# Altium schematic sheet RXTX4.SchDoc
size A
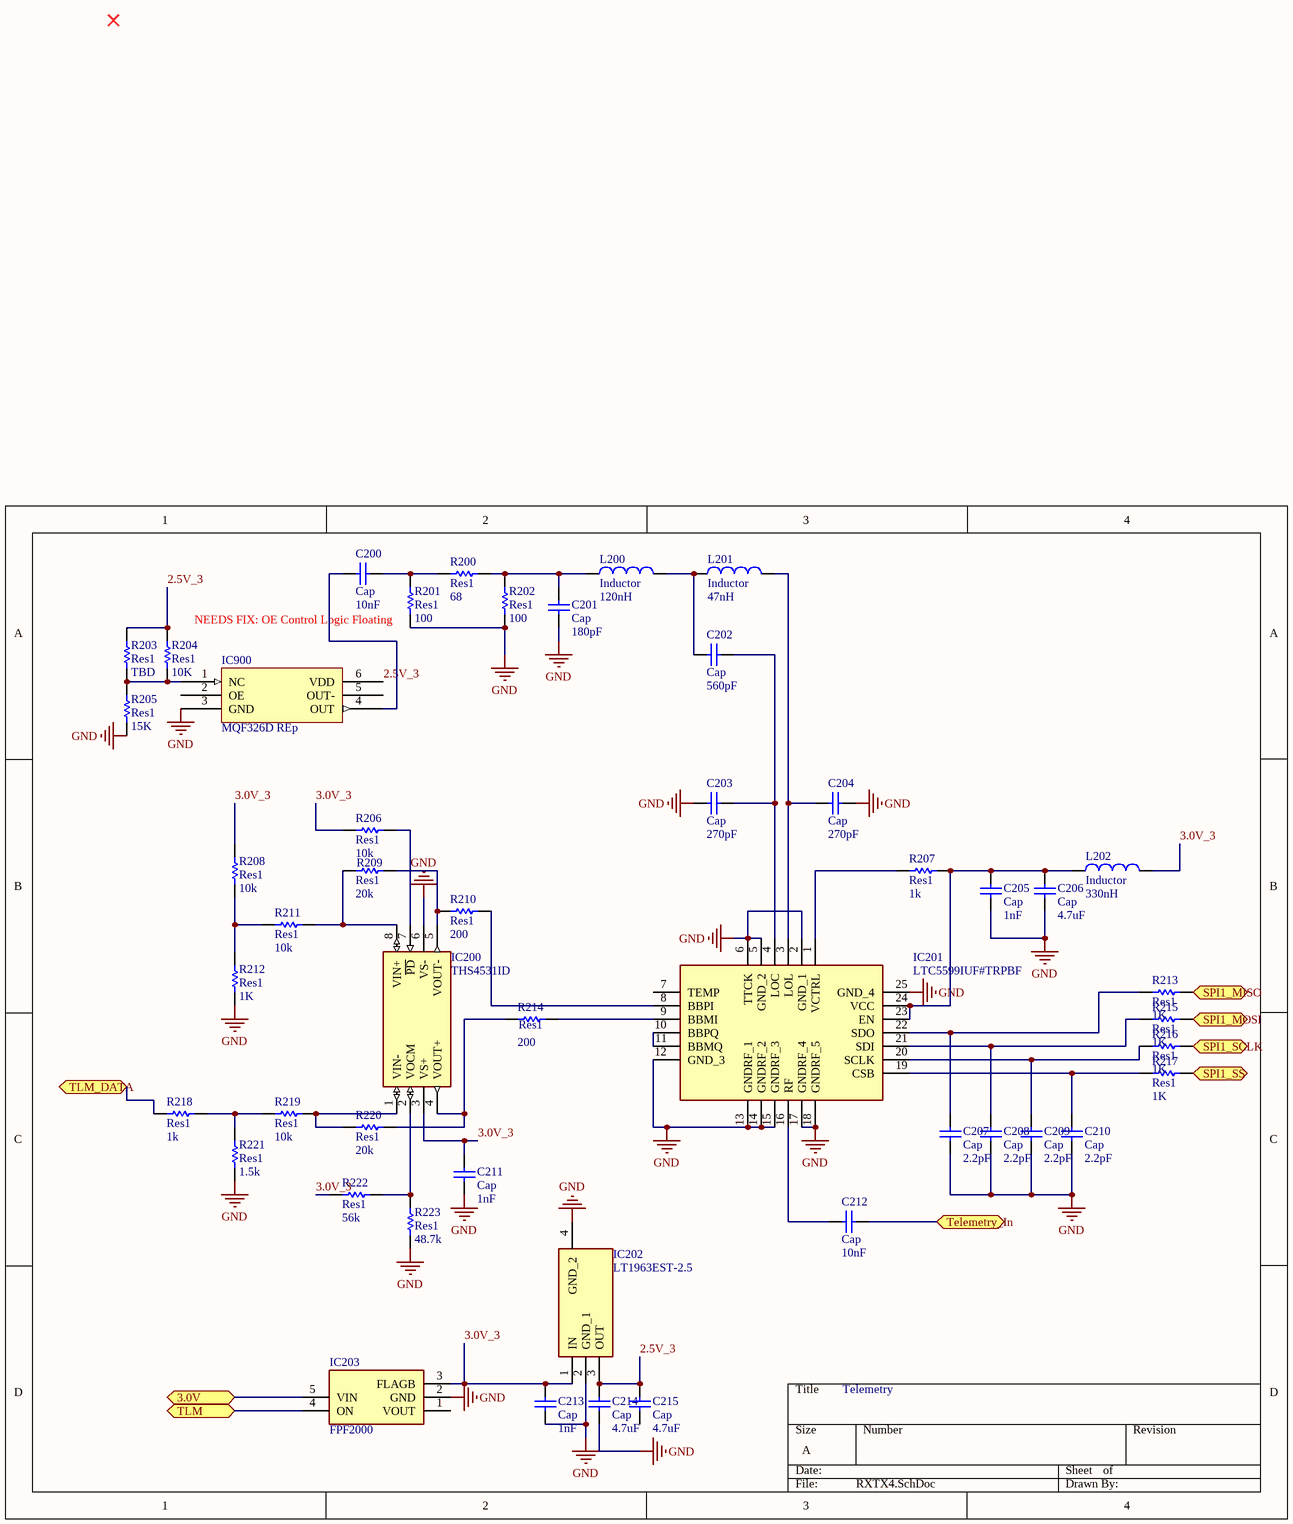
[diagram p0: RXTX4.SchDoc]

## Parts
C200  Cap  value 10nF  [0603]
C201  Cap  value 180pF  [0603]
C202  Cap  value 560pF  [0603]
C203  Cap  value 270pF  [0603]
C204  Cap  value 270pF  [0603]
C205  Cap  value 1nF  [0603]
C206  Cap  value 4.7uF  [0603]
C207  Cap  value 2.2pF  [0603]
C208  Cap  value 2.2pF  [0603]
C209  Cap  value 2.2pF  [0603]
C210  Cap  value 2.2pF  [0603]
C211  Cap  value 1nF  [0603]
C212  Cap  value 10nF  [0603]
C213  Cap  value 1nF  [0603]
C214  Cap  value 4.7uF  [0603]
C215  Cap  value 4.7uF  [0603]
IC200  THS4531ID  [SOIC127P600X175-8N]
IC201  LTC5599IUF#TRPBF  [QFN50P400X400X80-25N-D]
IC202  LT1963EST-2.5  [SOT230P700X180-4N]
IC203  FPF2000  [SOT65P210X110-5N]
IC900  MQF326D REp  [MQF326D]
L200  Inductor  value 120nH  [0603]
L201  Inductor  value 47nH  [0603]
L202  Inductor  value 330nH  [0603]
R200  Res1  value 68  [0603]
R201  Res1  value 100  [0603]
R202  Res1  value 100  [0603]
R203  Res1  value TBD  [0603]
R204  Res1  value 10K  [0603]
R205  Res1  value 15K  [0603]
R206  Res1  value 10k  [0603]
R207  Res1  value 1k  [0603]
R208  Res1  value 10k  [0603]
R209  Res1  value 20k  [0603]
R210  Res1  value 200  [0603]
R211  Res1  value 10k  [0603]
R212  Res1  value 1K  [0603]
R213  Res1  value 1K  [0603]
R214  Res1  value 200  [0603]
R215  Res1  value 1K  [0603]
R216  Res1  value 1K  [0603]
R217  Res1  value 1K  [0603]
R218  Res1  value 1k  [0603]
R219  Res1  value 10k  [0603]
R220  Res1  value 20k  [0603]
R221  Res1  value 1.5k  [0603]
R222  Res1  value 56k  [0603]
R223  Res1  value 48.7k  [0603]

## Ports
3.0V (bidir), SPI1_MISO (bidir), SPI1_MOSI (bidir), SPI1_SCLK (bidir), SPI1_SS (bidir), Telemetry_In (bidir), TLM (bidir), TLM_DATA (bidir)

## Nets
GND: C201.1 C203.2 C204.1 C205.2 C206.2 C207.2 C208.2 C209.2 C210.2 C211.2 C213.2 C214.2 IC200.6(VS-) IC201.2(GND_1) IC201.5(GND_2) IC201.6(TTCK) IC201.12(GND_3) IC201.13(GNDRF_1) IC201.14(GNDRF_2) IC201.15(GNDRF_3) IC201.17(GNDRF_4) IC201.18(GNDRF_5) IC201.25(GND_4) IC202.2(GND_1) IC202.4(GND_2) IC203.2(GND) IC900.3(GND) R201.1 R202.2 R205.1 R212.2 R221.1 R223.1
2.5V_3: C214.1 C215.1 IC202.3(OUT) IC900.6(VDD) R203.2 R204.2
3.0V: IC203.5(VIN) ; port 3.0V
3.0V_3: C211.1 C213.1 IC200.3(VS+) IC202.1(IN) IC203.3(FLAGB) L202.2 R206.1 R208.1 R222.1
SPI1_MISO: R213.2 ; port SPI1_MISO
SPI1_MOSI: R215.2 ; port SPI1_MOSI
SPI1_SCLK: R216.2 ; port SPI1_SCLK
SPI1_SS: R217.2 ; port SPI1_SS
Telemetry_In: C212.2 ; port Telemetry_In
TLM: IC203.4(ON) ; port TLM
TLM_DATA: R218.1 ; port TLM_DATA
NetC200_1: C200.1 IC900.4(OUT)
NetC200_2: C200.2 R200.2 R201.2
NetC201_2: C201.2 L200.1 R200.1 R202.1
NetC202_1: C202.1 C203.1 IC201.4(LOC)
NetC202_2: C202.2 L200.2 L201.1
NetC204_2: C204.2 IC201.3(LOL) L201.2
NetC205_1: C205.1 C206.1 IC201.23(EN) IC201.24(VCC) L202.1 R207.1
NetC207_1: C207.1 IC201.22(SDO) R213.1
NetC208_1: C208.1 IC201.21(SDI) R215.1
NetC209_1: C209.1 IC201.20(SCLK) R216.1
NetC210_1: C210.1 IC201.19(CSB) R217.1
NetC212_1: C212.1 IC201.16(RF)
NetIC200_1: IC200.1(VIN-) R219.2 R220.1
NetIC200_2: IC200.2(VOCM) R222.2 R223.2
NetIC200_4: IC200.4(VOUT+) R214.1 R220.2
NetIC200_5: IC200.5(VOUT-) R209.2 R210.1
NetIC200_7: IC200.7(~{PD}) R206.2
NetIC200_8: IC200.8(VIN+) R209.1 R211.2
NetIC201_1: IC201.1(VCTRL) R207.2
NetIC201_8: IC201.8(BBPI) R210.2
NetIC201_9: IC201.9(BBMI) R214.2
NetIC201_10: IC201.10(BBPQ) IC201.11(BBMQ)
NetIC900_1: IC900.1(NC) R203.1 R204.1 R205.2
NetR208_2: R208.2 R211.1 R212.1
NetR218_2: R218.2 R219.1 R221.2

Not connected (* = marked no-connect by the designer): C215 2; IC201 7(TEMP); IC203 1(VOUT); IC900 2(OE) 5(OUT-)

## Notes on the sheet
- (near R201) NEEDS FIX: OE Control Logic Floating
- Telemetry

## Library data of the parts
C200-C215 = Cap: Capacitor; Published: 8-Jun-2000; LatestRevisionDate: 17-Jul-2002; LatestRevisionNote: Re-released for DXP Platform.; PackageReference: RAD-0.3; Publisher: Altium Limited; PackageDescription: Radial Cap, Thru-Hole; 2 Leads; 0.3 in Pin Spacing
IC200 = THS4531ID: Integrated Circuit; Manufacturer_Name: Texas Instruments; Datasheet Link: http://www.ti.com/lit/gpn/ths4531; Height: 1.75mm; Manufacturer_Part_Number: THS4531ID; Mouser Part Number: 595-THS4531ID; Mouser Price/Stock: https://www.mouser.com/Search/Refine.aspx?Keyword=595-THS4531ID; RS Part Number: 7741408P; RS Price/Stock: http://uk.rs-online.com/web/p/products/7741408P
IC201 = LTC5599IUF#TRPBF: Integrated Circuit; Manufacturer_Name: Linear Technology; Datasheet Link: http://www.linear.com/docs/45277; Height: 0.8mm; Manufacturer_Part_Number: LTC5599IUF#TRPBF; Mouser Part Number: 584-LTC5599IUF#TRPBF; Mouser Price/Stock: https://www.mouser.com/Search/Refine.aspx?Keyword=584-LTC5599IUF%23TRPBF
IC202 = LT1963EST-2.5: Integrated Circuit; Manufacturer_Name: Linear Technology; Datasheet Link: https://www.mouser.com/datasheet/2/609/1963fc-1270290.pdf; Height: 1.8mm; Manufacturer_Part_Number: LT1963EST-2.5; Mouser Part Number: 584-LT1963EST-2.5; Mouser Price/Stock: https://www.mouser.com/Search/Refine.aspx?Keyword=584-LT1963EST-2.5
IC203 = FPF2000: Integrated Circuit; Manufacturer_Name: ON Semiconductor; Datasheet Link: https://www.onsemi.com/pub/Collateral/FPF2001-D.pdf; Height: 1.1mm; Manufacturer_Part_Number: FPF2000; Mouser Part Number: 512-FPF2000; Mouser Price/Stock: https://www.mouser.com/Search/Refine.aspx?Keyword=512-FPF2000; RS Part Number: 6709942P; RS Price/Stock: http://uk.rs-online.com/web/p/products/6709942P
IC900 = Component_1
L200-L202 = Inductor: Code_IEC: 1005; Published: 8-Jun-2000; LatestRevisionDate: 29-May-2009; LatestRevisionNote: IPC-7351 Footprint Added.; PackageReference: 0402-A; Publisher: Altium Limited; PackageDescription: Chip Inductor; Code_JEITA: 0402
R200-R223 = Res1: Resistor; Published: 8-Jun-2000; LatestRevisionDate: 17-Jul-2002; LatestRevisionNote: Re-released for DXP Platform.; PackageReference: AXIAL-0.3; Publisher: Altium Limited; PackageDescription: Axial Device, Thru-Hole; 2 Leads; 0.3 in Pin Spacing